# EAGLE design voltage_sensor_v0.3 (EAGLE 9.6.2)
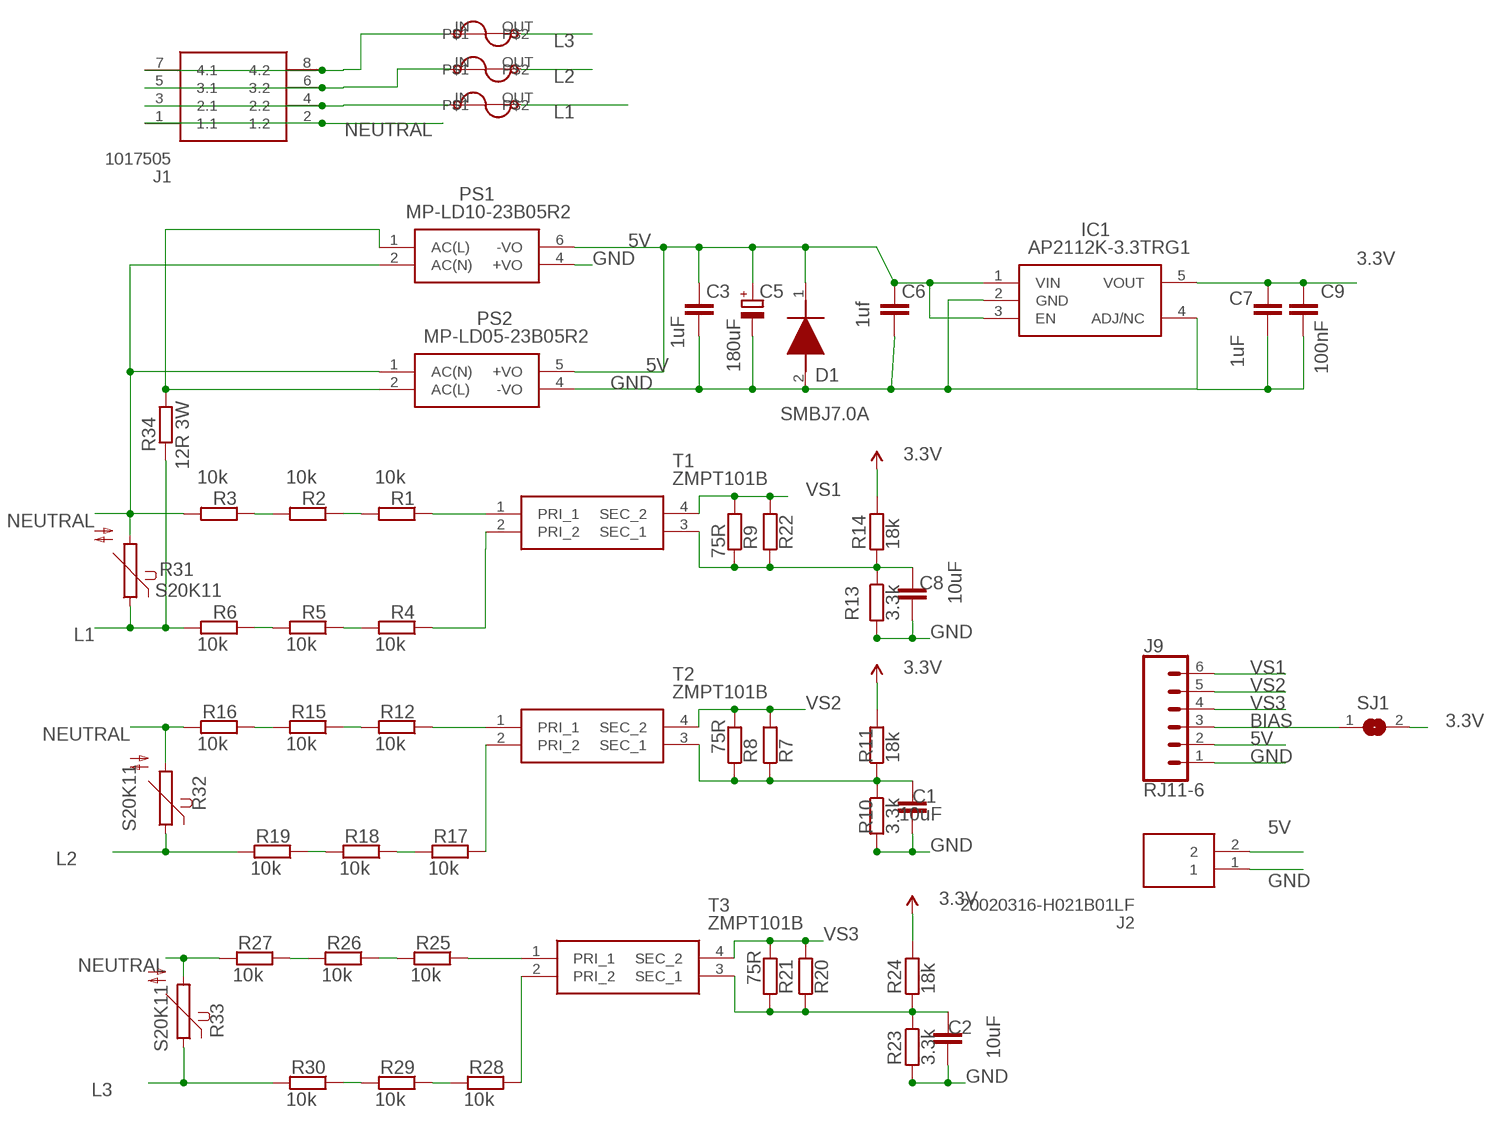
[diagram p0: schematic, sheet 1]

## Parts
C1  10uF  C-EUC0603  [C0603]
C2  10uF  C-EUC0603  [C0603]
C3  1uF  C-EUC0603  [C0603]
C5  180uF  CPOL-EUC  [PANASONIC_C]
C6  1uf  C-EUC0603  [C0603]
C7  1uF  C-EUC0603  [C0603]
C8  10uF  C-EUC0603  [C0603]
C9  100nF  C-EUC0603  [C0603]
D1  SMBJ7.0A  [DIOM5336X244N]
F1  2A/250V  BEL1AFUSE  [BELFUSE1A]
F2  2A/250V  BEL1AFUSE  [BELFUSE1A]
F3  2A/250V  BEL1AFUSE  [BELFUSE1A]
IC1  AP2112K-3.3TRG1  [SOT95P282X130-5N]
J1  1017505  [1017505]
J2  20020316-H021B01LF  [20020316H021B01LF]
J9  RJ11-6  [RJ11-6]
PS1  MP-LD10-23B05R2  MP-LD10-23B12R2  [MPLD1023B12R2]
PS2  MP-LD05-23B05R2  MP-LD05-23B03R2  [MPLD0523B03R2]
R1  10k  R-EU_R0603  [R0603]
R2  10k  R-EU_R0603  [R0603]
R3  10k  R-EU_R0603  [R0603]
R4  10k  R-EU_R0603  [R0603]
R5  10k  R-EU_R0603  [R0603]
R6  10k  R-EU_R0603  [R0603]
R7  R-EU_0204/7  [0204/7]
R8  75R  R-EU_R0603  [R0603]
R9  75R  R-EU_R0603  [R0603]
R10  3.3k  R-EU_R0603  [R0603]
R11  18k  R-EU_R0603  [R0603]
R12  10k  R-EU_R0603  [R0603]
R13  3.3k  R-EU_R0603  [R0603]
R14  18k  R-EU_R0603  [R0603]
R15  10k  R-EU_R0603  [R0603]
R16  10k  R-EU_R0603  [R0603]
R17  10k  R-EU_R0603  [R0603]
R18  10k  R-EU_R0603  [R0603]
R19  10k  R-EU_R0603  [R0603]
R20  R-EU_0204/7  [0204/7]
R21  75R  R-EU_R0603  [R0603]
R22  R-EU_0204/7  [0204/7]
R23  3.3k  R-EU_R0603  [R0603]
R24  18k  R-EU_R0603  [R0603]
R25  10k  R-EU_R0603  [R0603]
R26  10k  R-EU_R0603  [R0603]
R27  10k  R-EU_R0603  [R0603]
R28  10k  R-EU_R0603  [R0603]
R29  10k  R-EU_R0603  [R0603]
R30  10k  R-EU_R0603  [R0603]
R31  S20K11  [S20K11]
R32  S20K11  [S20K11]
R33  S20K11  [S20K11]
R34  12R 3W  R-EU_R2512  [R2512]
SJ1  SJ  [SJ]
T1  ZMPT101B  [ZMPT101B]
T2  ZMPT101B  [ZMPT101B]
T3  ZMPT101B  [ZMPT101B]

## Nets
3.3V: C7.1 C9.1 IC1.5(VOUT) R11.2 R14.2 R24.2 SJ1.2
5V: C3.1 C5.+ C6.1 D1.1(K) IC1.1(VIN) IC1.3(EN) J2.2 J9.2 PS1.6(-VO) PS2.5(+VO)
BIAS: J9.3 SJ1.1
GND: C1.2 C2.2 C3.2 C5.- C6.2 C7.2 C8.2 C9.2 D1.2(A) IC1.2(GND) IC1.4(ADJ/NC) J2.1 J9.1 PS1.4(+VO) PS2.4(-VO) R10.2 R13.2 R23.2
L1: F1.OUT R6.2 R31.1 R34.1
L2: F2.OUT R19.2 R32.1
L3: F3.OUT R30.2 R33.1
N$1: R1.1 T1.1(PRI_1)
N$2: R4.1 T1.2(PRI_2)
N$3: R1.2 R2.1
N$4: R4.2 R5.1
N$5: R5.2 R6.1
N$6: R2.2 R3.1
N$7: F1.IN J1.3(2.1) J1.4(2.2)
N$8: F2.IN J1.5(3.1) J1.6(3.2)
N$9: C1.1 R7.1 R8.1 R10.1 R11.1 T2.3(SEC_1)
N$10: R12.1 T2.1(PRI_1)
N$11: R17.1 T2.2(PRI_2)
N$12: R12.2 R15.1
N$13: R17.2 R18.1
N$14: R18.2 R19.1
N$15: R15.2 R16.1
N$16: F3.IN J1.7(4.1) J1.8(4.2)
N$17: PS1.1(AC(L)) PS2.2(AC(L)) R34.2
N$18: C2.1 R20.1 R21.1 R23.1 R24.1 T3.3(SEC_1)
N$19: R25.1 T3.1(PRI_1)
N$20: R28.1 T3.2(PRI_2)
N$21: R25.2 R26.1
N$22: R28.2 R29.1
N$23: R29.2 R30.1
N$24: R26.2 R27.1
N$25: C8.1 R9.1 R13.1 R14.1 R22.1 T1.3(SEC_1)
NEUTRAL: J1.1(1.1) J1.2(1.2) PS1.2(AC(N)) PS2.1(AC(N)) R3.2 R16.2 R27.2 R31.2 R32.2 R33.2
VS1: J9.6 R9.2 R22.2 T1.4(SEC_2)
VS2: J9.5 R7.2 R8.2 T2.4(SEC_2)
VS3: J9.4 R20.2 R21.2 T3.4(SEC_2)

## Library data of the parts
C1-C3 C6-C9 = resistor:C-EU: CAPACITOR, European symbol
C5 = rcl:CPOL-EU: POLARIZED CAPACITOR, European symbol; SPICEPREFIX: C
D1 = SMBJ7.0A:SMBJ7.0A: TVS, SMD, 600W, 7V HY Electronic Corp SMBJ7.0A Uni-Directional TVS Diode, 600 (Min.)W peak, 2-Pin SMB Source: Datasheet; DESCRIPTION: TVS, SMD, 600W, 7V HY Electronic Corp SMBJ7.0A Uni-Directional TVS Diode, 600 (Min.)W peak, 2-Pin SMB; HEIGHT: 2.44mm; MANUFACTURER_NAME: HY Electronic Corp; MANUFACTURER_PART_NUMBER: SMBJ7.0A
F1-F3 = Qxd:BEL1AFUSE
IC1 = AP2112K-3.3TRG1:AP2112K-3.3TRG1: 600mA 3.3V LDO Regulator Enable SOT23-5 DiodesZetex AP2112K-3.3TRG1, LDO Voltage Regulator, 3.3 V +/-1.5%, 2.5 6 Vin, 5-Pin SOT-23 Source: Datasheet <http://uk.rs-online.com/web/p/products/8283509>; ARROW_PART_NUMBER: AP2112K-3.3TRG1; ARROW_PRICE-STOCK: https://www.arrow.com/en/products/ap2112k-3.3trg1/diodes-incorporated?region=nac; DESCRIPTION: 600mA 3.3V LDO Regulator Enable SOT23-5 DiodesZetex AP2112K-3.3TRG1, LDO Voltage Regulator, 3.3 V +/-1.5%, 2.5 6 Vin, 5-Pin SOT-23; HEIGHT: 1.3mm; MANUFACTURER_NAME: Diodes Inc.; MANUFACTURER_PART_NUMBER: AP2112K-3.3TRG1; MOUSER_PART_NUMBER: 621-AP2112K-3.3TRG1; MOUSER_PRICE-STOCK: https://www.mouser.co.uk/ProductDetail/Diodes-Incorporated/AP2112K-33TRG1?qs=x6A8l6qLYDDPYHosCdzh%2FA%3D%3D
J1 = 1017505:1017505: PCB terminal block, nominal current: 32 A, rated voltage (III/2): 400 V, nominal cross section: 2.5 mm?, Number of potentials: 4, Number of rows: 1, Number of positions per row: 4, product range: TDPT 2,5/..-SP, pitch: 5.08 mm, connection method: Push-in spring connection, mounting: Wave soldering, conductor/PCB connection direction: 0 ?, color: green, Pin layout: Linear double pinning, Solder pin [P]: 3.5 mm, type of packaging: packed in cardboard Source: Datasheet <http://www.phoenixcontact.com/de/produkte/1017505/pdf>; ARROW_PART_NUMBER: 1017505; ARROW_PRICE-STOCK: https://www.arrow.com/en/products/1017505/phoenix-contact; DESCRIPTION: PCB terminal block, nominal current: 32 A, rated voltage (III/2): 400 V, nominal cross section: 2.5 mm?, Number of potentials: 4, Number of rows: 1, Number of positions per row: 4, product range: TDPT 2,5/..-SP, pitch: 5.08 mm, connection method: Push-in spring connection, mounting: Wave soldering, conductor/PCB connection direction: 0 ?, color: green, Pin layout: Linear double pinning, Solder pin [P]: 3.5 mm, type of packaging: packed in cardboard; HEIGHT: 19.2mm; MANUFACTURER_NAME: Phoenix Contact; MANUFACTURER_PART_NUMBER: 1017505; MOUSER_PART_NUMBER: 651-1017505; MOUSER_PRICE-STOCK: https://www.mouser.co.uk/ProductDetail/Phoenix-Contact/1017505?qs=F5EMLAvA7IDSv5uM7A6HhA%3D%3D
J2 = 20020316-H021B01LF:20020316-H021B01LF: Conn Pluggable Terminal Block 2 POS 5.08mm Screw RA Thru-Hole 16A/Contact Box Source: Datasheet <https://datasheet.datasheetarchive.com/originals/distributors/Datasheets-DGA18/1074774.pdf>; ARROW_PART_NUMBER: 20020316-H021B01LF; ARROW_PRICE-STOCK: https://www.arrow.com/en/products/20020316-h021b01lf/amphenol; DESCRIPTION: Conn Pluggable Terminal Block 2 POS 5.08mm Screw RA Thru-Hole 16A/Contact Box; HEIGHT: 13.8mm; MANUFACTURER_NAME: Amphenol; MANUFACTURER_PART_NUMBER: 20020316-H021B01LF; MOUSER_PART_NUMBER: N/A; MOUSER_PRICE-STOCK: https://www.mouser.co.uk/ProductDetail/Amphenol/20020316-H021B01LF?qs=W0yvOO0ixfFlV4eKhSWD3Q%3D%3D
J9 = SparkFun-Connectors:RJ11-6: RJ11 Jack - 6 pin Commonly found on CAT3 devices and some Microchip programmers. Here is the connector we sell at SparkFun: RJ11 6-Pin Connector <https://www.sparkfun.com/products/132> (PRT-00132) Datasheet <http://www.sparkfun.com/datasheets/Prototyping/Connectors/RJ11-Datasheet.pdf> It is used on this SparkFun product: SparkFun Weather Shield <https://www.sparkfun.com/products/12081> (DEV-12081) Weather Meters <https://www.sparkfun.com/products/8942> (SEN-08942); PROD_ID: CONN-08590; SF_ID: PRT-00132; VALUE: RJ11
PS1 = MP-LD10-23B12R2:MP-LD10-23B12R2: MULTICOMP PRO - MP-LD10-23B05R2 - AC/DC PCB Mount Power Supply (PSU), 100 to 430VDC, ITE, Household, Medical & Transformers, 5V Output Source: Datasheet <https://componentsearchengine.com/Datasheets/2/MP-LD10-23B05R2.pdf>; DESCRIPTION: MULTICOMP PRO - MP-LD10-23B12R2 - AC/DC PCB Mount Power Supply (PSU), 100 to 430VDC, ITE, Household, Medical & Transformers, 1 Output; HEIGHT: 21.5mm; MANUFACTURER_NAME: MULTICOMP; MANUFACTURER_PART_NUMBER: MP-LD10-23B05R2
PS2 = MP-LD05-23B03R2:MP-LD05-23B03R2: POWER SUPPLY, AC-DC, 3.3V, 1.515A Source: Datasheet <https://www.farnell.com/datasheets/3167202.pdf>; DESCRIPTION: POWER SUPPLY, AC-DC, 3.3V, 1.515A; HEIGHT: 18.1mm; MANUFACTURER_NAME: MULTICOMP; MANUFACTURER_PART_NUMBER: MP-LD05-23B03R2
R1-R30 = rcl:R-EU_: RESISTOR, European symbol
R31-R33 = varistor:S20K11: VARISTOR
R34 = rcl:R-EU_: RESISTOR, European symbol; SPICEPREFIX: R
SJ1 = jumper:SJ: SMD solder JUMPER
T1-T3 = ZMPT101B:ZMPT101B: Current-type Voltage Transformer Source: Datasheet; DESCRIPTION: Current-type Voltage Transformer; HEIGHT: 18.8mm; MANUFACTURER_NAME: Qingxian Zeming Langxi Electronic; MANUFACTURER_PART_NUMBER: ZMPT101B

## Net classes
0 default: clearance 0.205 mm
1 power: width 0.305 mm, drill 0.6 mm, clearance 0.254 mm
2 gnd: width 0.254 mm, drill 0.6 mm, clearance 0.254 mm

## Board
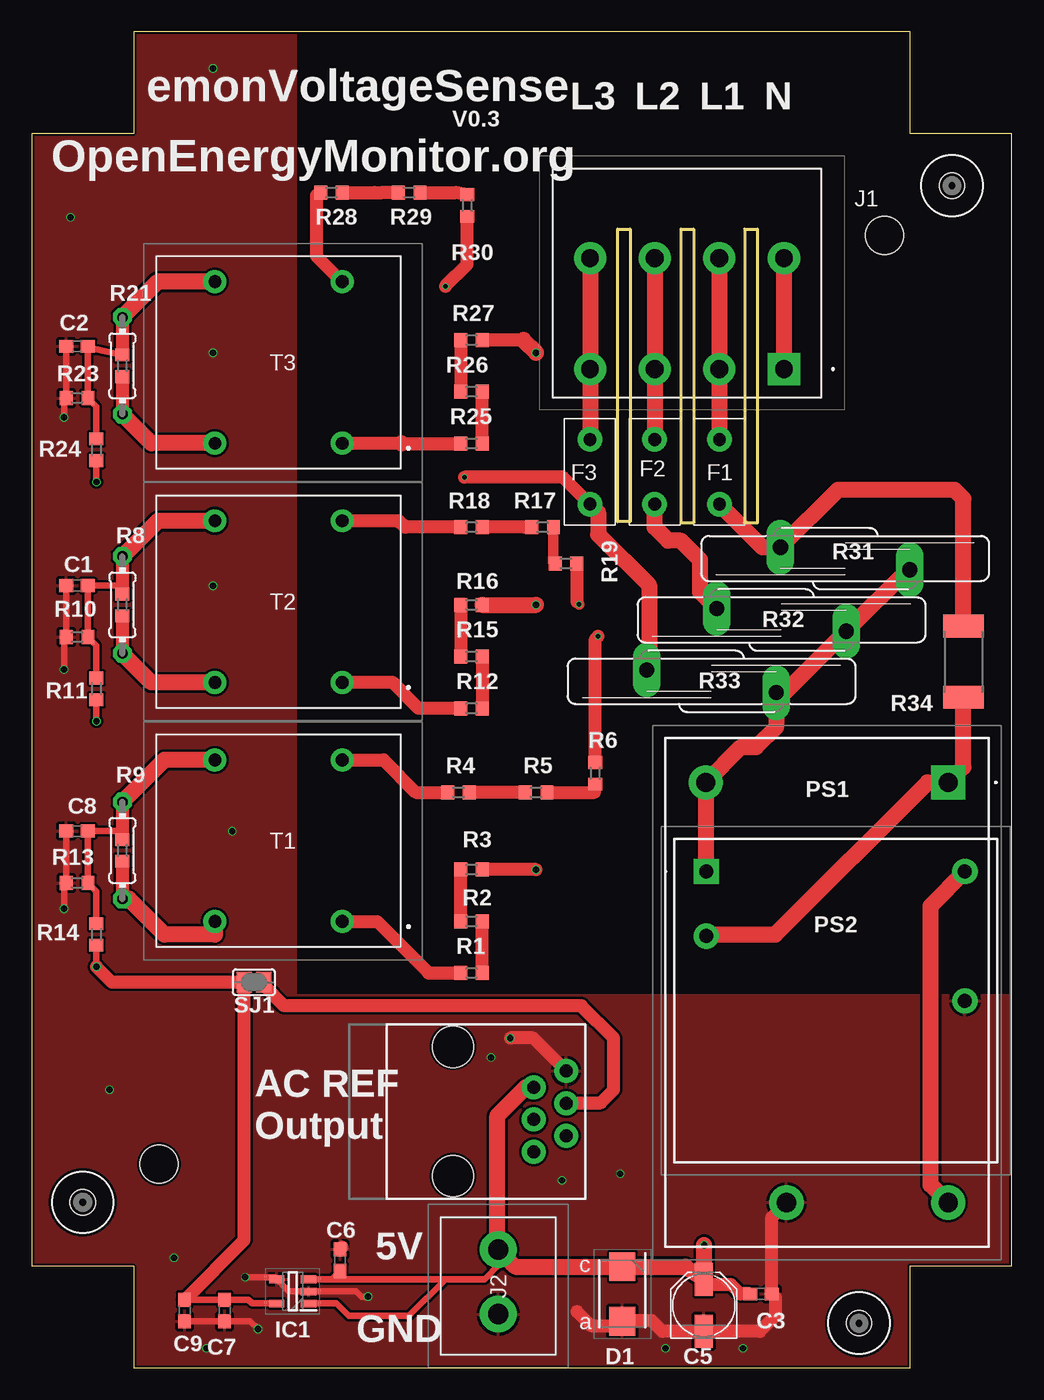
[diagram p1: board, top side]
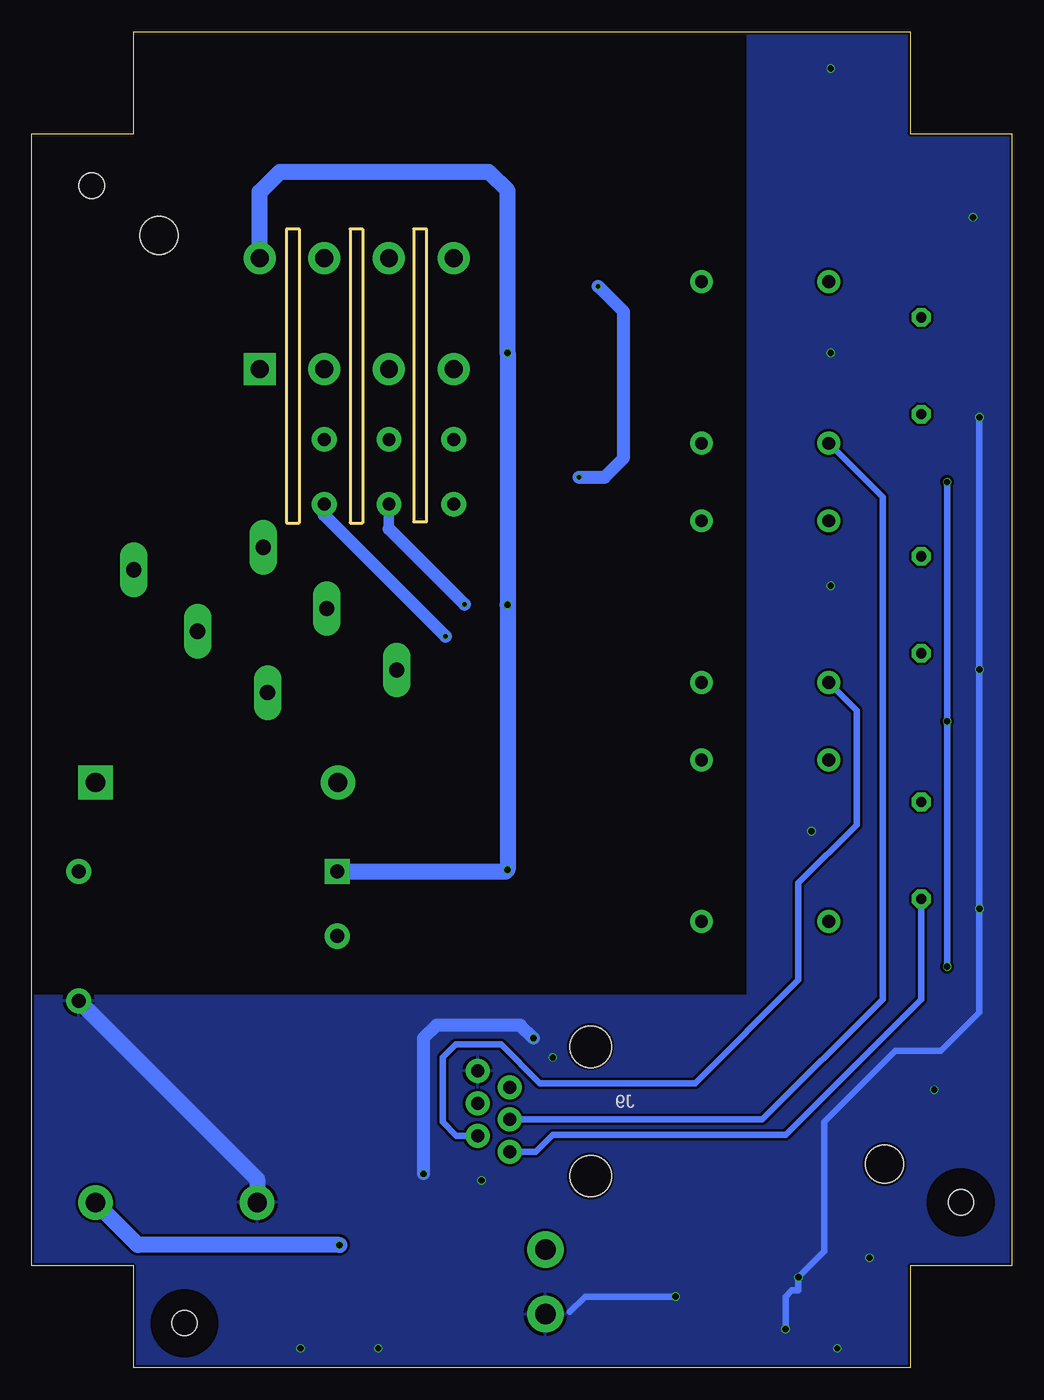
[diagram p2: board, bottom side, seen from below]

Size 77 x 105 mm. Coordinates in mm from the lower left corner, seen from the top.
Outline: 0,8 8,8 8,0 69,0 69,8 77,8 77,97 69,97 69,105 8,105 8,97 0,97 0,8
Copper layers (1*16): Top 0.035mm / dielectric 1.6mm / Bottom 0.035mm
Design rules "jlcpcb-2layers *": minimum track width 5mil, minimum drill 0.3mm, track to track 5mil, track to pad 5mil, pad to pad 5mil, via to via 5mil, smd to smd 5mil, copper to edge 0.2mm, drill to drill 6mil, minimum pad ring 10mil, minimum via ring 3mil, stop-mask expansion 4mil, vias tented up to drill 20mil, thermal gap 10mil
Holes 3 mm at 10,16 67,89
Milling: 12 lines

### Footprints (pad centres in the part's own frame; a part is rotated, then mirrored left to right if it is on the bottom)
C0603 = smd 1.1 x 1: 1 -0.85,0; 2 0.85,0
PANASONIC_C = smd 2.6 x 1.4: + 2.05,0; - -2.05,0
DIOM5336X244N = smd 2.25 x 2.05: 1 -2.15,0; 2 2.15,0
BELFUSE1A = drill 1 pad 1.93: IN 2,1.66; OUT 2,6.74
SOT95P282X130-5N = smd 1.2 x 0.6: 1 -1.25,0.95; 2 -1.25,0; 3 -1.25,-0.95; 4 1.25,-0.95; 5 1.25,0.95
1017505 = drill 1.4 pad 2.1 square: 1 0,0 | drill 1.4 pad 2.1: 2 0,-8.7; 3 5.08,0; 4 5.08,-8.7; 5 10.16,0; 6 10.16,-8.7; 7 15.24,0; 8 15.24,-8.7
20020316H021B01LF = drill 1.6 pad 2.4: 1 0,0; 2 5.08,0
RJ11-6 = drill 1.016 pad 1.88: 1 -3.175,8.89; 2 -1.905,6.35; 3 -0.635,8.89; 4 0.635,6.35; 5 1.905,8.89; 6 3.175,6.35 | hole 3.251: -5.08,0; 5.08,0
MPLD1023B12R2 = drill 1.5 pad 2.25 square: 1 0,0 | drill 1.5 pad 2.25: 2 0,-19.05; 4 33.02,-12.705; 6 33.02,0
MPLD0523B03R2 = drill 1.1 pad 1.65 square: 1 0,0 | drill 1.1 pad 1.65: 2 0,-5.08; 4 20.32,-10.16; 5 20.32,0
R0603 = smd 1 x 1.1: 1 -0.85,0; 2 0.85,0
0204/7 = drill 0.813 octagon: 1 -3.81,0; 2 3.81,0
S20K11 = drill 1.194 long: 1 -0.889,-5.08; 2 0.889,5.08
R2512 = smd 1.8 x 3.2: 1 -2.8,0; 2 2.8,0
SJ = smd 1.168 x 1.6: 1 -0.762,0; 2 0.762,0
ZMPT101B = drill 1 pad 1.5: 1 0,0; 2 0,-12.7; 3 10,-12.7; 4 10,0
DRIL-2 = hole 2: 0,0

### Placement (x,y rotation side)
C1  3.56,61.48 180 top
C2  3.56,80.28 180 top
C3  57.3,5.8 0 top
C5  52.8,4.9 90 top
C6  24.22,8.46 90 top
C7  15.15,4.5 270 top
C8  3.56,42.18 180 top
C9  12,4.5 270 top
D1  46.4,5.8 270 top
F1  56.02,74.61 180 top
F2  50.94,74.61 180 top
F3  45.85,74.61 180 top
IC1  20.5,6 180 top
J1  59.1,78.5 180 top
J2  36.65,4.21 90 top
J9  33.09,20.14 270 top
PS1  72,46 270 top
PS2  53,39 0 top
R1  34.54,31.02 0 top
R2  34.54,35.08 180 top
R3  34.54,39.15 0 top
R4  33.53,45.23 0 top
R5  39.62,45.23 0 top
R6  44.27,46.72 90 top
R7  7.11,59.96 270 top
R8  7.11,59.96 270 top
R9  7.11,40.66 270 top
R10  3.56,57.42 180 top
R11  5.08,53.36 270 top
R12  34.54,51.83 0 top
R13  3.56,38.12 180 top
R14  5.08,34.05 270 top
R15  34.54,55.9 180 top
R16  34.54,59.96 0 top
R17  34.54,66.06 0 top
R18  40.13,66.06 0 top
R19  41.97,63.2 0 top
R20  7.11,78.76 270 top
R21  7.11,78.76 270 top
R22  7.11,40.66 270 top
R23  3.56,76.22 180 top
R24  5.08,72.15 270 top
R25  34.54,72.64 0 top
R26  34.54,76.71 180 top
R27  34.54,80.77 0 top
R28  23.54,92.36 0 top
R29  29.64,92.36 0 top
R30  34.21,91.34 270 top
R31  63.9,63.6 270 top
R32  58.9,58.78 270 top
R33  53.4,53.95 270 top
R34  73.2,55.5 270 top
SJ1  17.45,30.3 180 top
T1  24.38,35.07 180 top
T2  24.38,53.86 180 top
T3  24.38,72.66 180 top
U$1  [DRIL-2]  65,3.5 0 top
U$2  [DRIL-2]  4,13 0 top
U$3  [DRIL-2]  72.3,92.9 0 top

### Tracks (layer width: path | path; a pad name or v marks a point on that pad's centre or on a via)
3.3V  (via drill 0.5)
  Top 0.508: R24.2 v5.08,69.61 | R11.2 v5.08,50.82 | R14.2 v5.08,31.51 | IC1.5 17.3,5.05 17,5.35 C7.1 C9.1
  Top 1.016: v5.08,31.51 6.3,30.3 SJ1.2 16.69,10.04 C9.1
  Bottom 0.508: v5.08,69.61 v5.08,50.82 v5.08,31.51
5V  (via drill 0.5)
  Top 0.508: 32.51,6.95 IC1.3 23.56,6.95 C6.1 | 32.51,6.95 35.57,6.95 36.65,8.03 J2.2 | IC1.1 23.91,5.05 24.89,4.06 29.63,4.06 32.51,6.95
  Top 1.016: C3.1 55.67,5.8 54.94,6.53 52.83,6.53
  Top 1.27: PS1.6 70.61,14.37 70.61,36.29 PS2.5 | v52.83,9.65 52.83,6.53 C5.+ 51.35,7.95 D1.1 37.99,7.95 J2.2 36.58,9.36 36.58,19.81 38.81,22.05 J9.2
  Bottom 1.27: v52.83,9.65 68.67,9.65 PS1.6
BIAS
  Top 1.016: J9.3 42.03,20.83 44.7,20.83 45.72,21.84 45.72,25.91 43.18,28.45 19.81,28.45 18.21,30.05 SJ1.1
GND  (via drill 0.5)
  Top 0.508: C2.2 R23.2 2.54,76.05 v2.54,74.69 | C1.2 R10.2 2.54,57.25 v2.54,54.88 | v2.54,36.08 2.54,37.95 R13.2 C8.2 | v26.42,5.59 25.91,5.59 25.5,6 IC1.2 20.2,6 IC1.4 19.09,7.11 v16.76,7.11 | C9.2 C7.2 17.18,3.65 v17.78,3.05
  Top 1.016: PS1.4 58.15,11.84 C3.2 58.42,5.53 58.42,4.06 57.21,2.85 C5.- 49.55,2.85 48.7,3.7 47.15,3.7 46.75,3.3 | 46.75,3.3 D1.2 | 46.75,3.3 43.94,3.3 42.84,4.4 | J9.1 39.38,25.91 v37.59,25.91 | 24.38,9.47 C6.2
  Bottom 0.508: v2.54,74.69 v2.54,54.88 v2.54,36.08 2.54,27.94 5.59,24.89 9.14,24.89 14.73,19.3 14.73,9.14 v16.76,7.11 16.76,6.1 17.27,6.1 17.78,5.59 v17.78,3.05 | v26.42,5.59 33.53,5.59 34.72,4.4
  Bottom 1.016: v37.59,25.91 38.61,26.92 45.21,26.92 46.23,25.91 v46.23,15.24
  Bottom 1.27: PS1.4 59.3,14.81 PS2.4
  other vias: 6.1,21.84 15.75,42.16 14.22,61.47 14.22,79.76 3.05,90.42 14.22,102.11 11.18,8.64 13.72,1.52 55.88,1.52 49.78,1.52 36.07,24.38 41.66,14.73
  pour Top: -1,105 -1,-1 79,-1 79,29.23 20.72,29.23 20.72,105
  pour Bottom: -2,106 -2,-2 80,-2 80,29.23 20.72,29.23 20.72,105 8,105 7,106
L1  (via drill 0.35)
  Top 1.016: v44.5,57.5 44.27,57.27 R6.2
  Top 1.27: F1.OUT 57.41,64.49 R31.1 63.33,69 72.5,69 73.2,68.3 R34.1
  Bottom 1.016: v44.5,57.5 54.02,67.02 F1.OUT
L2  (via drill 0.35)
  Top 0.813: 42.82,60.18 v43,60
  Top 1.016: R19.2 42.82,60.18
  Top 1.27: R32.1 52.5,60.98 52.5,63.5 51,65 50,65 48.94,66.06 F2.OUT
  Bottom 0.813: 48.94,65.94 F2.OUT
  Bottom 1.016: v43,60 48.94,65.94
L3  (via drill 0.35)
  Top 1.016: F3.OUT 41.72,70 v34,70 | v32.5,85 34.21,86.71 R30.2
  Top 1.27: F3.OUT 44.5,67.22 44.5,65.5 48.5,61.5 48.5,55.02 R33.1
  Bottom 1.016: v34,70 32,70 30.5,71.5 30.5,83 v32.5,85
N$1
  Top 1.016: T1.1 27.14,35.07 31.18,31.02 R1.1
N$2
  Top 1.016: T1.2 27.64,47.77 30.18,45.23 R4.1
N$3
  Top 1.016: R1.2 R2.1
N$4
  Top 1.016: R5.1 R4.2
N$5
  Top 1.016: R6.1 44.2,45.23 R5.2
N$6
  Top 1.016: R2.2 R3.1
N$7
  Top 1.27: J1.4 J1.3 F1.IN
N$8
  Top 1.27: J1.6 J1.5 F2.IN
N$9
  Top 0.508: R11.1 5.08,56.75 R10.1 C1.1 7.01,61.48 R8.1
  Top 1.016: R7.1 R8.1
  Top 1.27: T2.3 9.91,66.56 R7.1
N$10
  Top 1.016: R12.1 30.37,51.83 28.34,53.86 T2.1
N$11
  Top 1.016: R17.1 29.36,66.06 28.85,66.56 T2.2
N$12
  Top 1.016: R15.1 R12.2
N$13
  Top 0.61: R18.1 38.71,66.06
  Top 1.016: 38.71,66.06 R17.2
N$14
  Top 0.813: R19.1 40.98,63.34 R18.2
N$15
  Top 1.016: R16.1 R15.2
N$16
  Top 1.27: J1.8 J1.7 43.86,72.96 F3.IN
N$17
  Top 1.27: PS2.2 53.12,34.04 58.42,34.04 70.38,46 PS1.1 73.2,47.2 R34.2
N$18
  Top 0.508: R24.1 5.08,75.54 R23.1 C2.1 4.51,80.18 R21.1
  Top 1.016: R20.1 R21.1
  Top 1.27: T3.3 9.91,85.36 R20.1
N$19
  Top 1.016: T3.1 29.04,72.66 | 29.05,72.64 R25.1
  Top 1.27: 29.05,72.64 29.04,72.66
N$20
  Top 1.016: R28.1 22.35,92.13 22.35,87.38 24.37,85.36
  Top 1.27: 24.37,85.36 T3.2
N$21
  Top 1.016: R25.2 R26.1
N$22
  Top 1.016: R28.2 26.92,92.36 27.53,92.36 R29.1
N$23
  Top 1.016: R29.2 33.33,92.36 R30.1
N$24
  Top 1.016: R27.1 R26.2
N$25
  Top 0.508: R14.1 5.08,37.44 R13.1 C8.1 7.01,42.18 R9.1
  Top 1.016: R22.1 R9.1
  Top 1.27: T1.3 10.41,47.77 R22.1
NEUTRAL  (via drill 0.5)
  Top 1.016: v39.62,39.15 R3.2 | 38.62,80.77 R27.2
  Top 1.27: 38.62,80.77 v39.62,79.77 | R16.2 v39.62,59.96 | PS2.1 52.95,39.05 PS1.2 55.72,48.77 56.9,48.77 58.48,50.35 R33.2 59.16,53.06 R32.2 68.8,62.71 R31.2 | J1.1 J1.2
  Bottom 1.27: PS2.1 39.77,39 v39.62,39.15 v39.62,59.96 v39.62,79.77 39.62,92.5 41.12,94 57.5,94 59.1,92.4 J1.2
VS1
  Top 0.508: R22.2 7.62,36.85 | 7.62,36.85
  Top 1.016: R9.2 R22.2
  Top 1.27: 14.38,34.05 10.41,34.05 7.62,36.85 | T1.4 14.38,34.05 | 14.38,34.05
  Bottom 0.508: J9.6 37.39,16.96 36.07,18.29 17.78,18.29 7.11,28.96 R22.2
VS2
  Top 1.016: R8.2 R7.2
  Top 1.27: T2.4 9.4,53.86 R7.2
  Bottom 0.508: T2.4 12.19,51.67 12.19,42.67 16.76,38.1 16.76,30.48 24.89,22.35 37.08,22.35 40.13,25.4 43.69,25.4 44.7,24.38 44.7,19.3 43.63,18.23 J9.5
VS3
  Top 1.016: R21.2 R20.2
  Top 1.27: T3.4 9.4,72.66 R20.2
  Bottom 0.508: T3.4 10.16,68.44 10.16,28.96 19.61,19.5 J9.4

### Text on the board
tNames: emonVoltageSense | L3 | L2 | L1 | N | V0.3 | OpenEnergyMonitor.org | AC REF / Output | 5V | c | a | GND
tSilk: 3.3V BIAS EN